# Altium schematic sheet TriggerPadSchematic.SchDoc
size A4; SheetNumber: 1; SheetTotal: 2
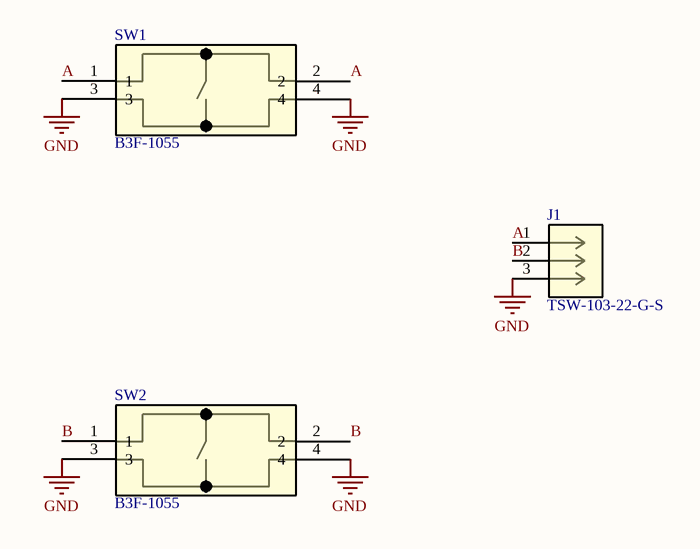
[diagram p0: TriggerPadSchematic.SchDoc]

## Parts
J1  TSW-103-22-G-S  [CON3_1X3_TU_TSW]
SW1  B3F-1055  [SW_B3F-1050_OMR]
SW2  B3F-1055  [SW_B3F-1050_OMR]

## Nets
GND: J1.3 SW1.3 SW1.4 SW2.3 SW2.4
A: J1.1 SW1.1 SW1.2
B: J1.2 SW2.1 SW2.2

## Library data of the parts
J1 = TSW-103-22-G-S: No Description Available; Manufacturer_Name: Samtec Inc; Copyright: Copyright (C) 2026 Ultra Librarian. All rights reserved.; Manufacturer_Part_Number: TSW-103-22-G-S; RefDes: RefDes; Type: Type
SW1 SW2 = B3F-1055: Description; Manufacturer_Name: Omron; Copyright: Copyright (C) 2025 Ultra Librarian. All rights reserved.; Manufacturer_Part_Number: B3F-1055; RefDes: RefDes; Type: Type